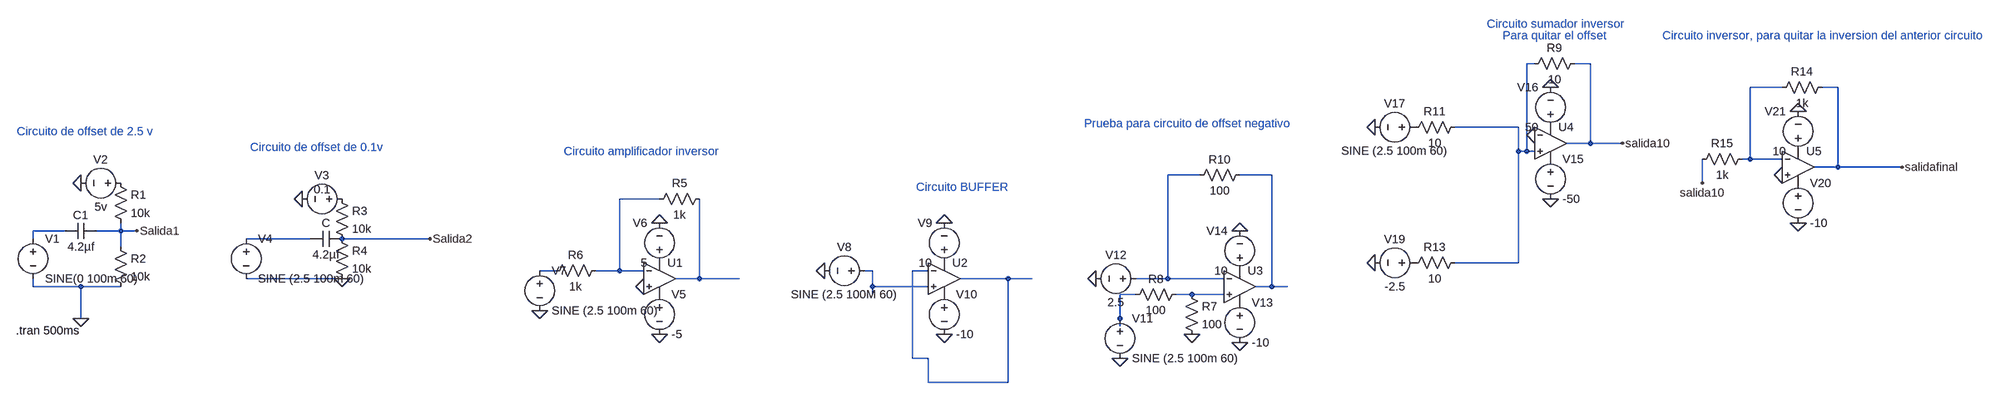
[diagram p0: schematic Simulaciones para la entrada y salida del audio con Amplificadores operacionales.asc]
Simulaciones para la entrada y salida del audio con Amplificadores operacionales.asc, the LTspice schematic file:
Version 4
SHEET 1 4508 680
WIRE 3536 -224 3520 -224
WIRE 3648 -224 3616 -224
WIRE 4032 -176 3968 -176
WIRE 4144 -176 4112 -176
WIRE 3504 -96 3376 -96
WIRE 3648 -64 3648 -224
WIRE 3648 -64 3600 -64
WIRE 3712 -64 3648 -64
WIRE 3504 -48 3504 -96
WIRE 3520 -48 3520 -224
WIRE 3520 -48 3504 -48
WIRE 3536 -48 3520 -48
WIRE 3968 -32 3968 -176
WIRE 3968 -32 3952 -32
WIRE 4032 -32 3968 -32
WIRE 4144 -16 4144 -176
WIRE 4144 -16 4096 -16
WIRE 4272 -16 4144 -16
WIRE 2672 0 2608 0
WIRE 2816 0 2752 0
WIRE 3872 16 3872 -32
WIRE 1408 48 1328 48
WIRE 80 112 16 112
WIRE 192 112 192 96
WIRE 192 112 144 112
WIRE 224 112 192 112
WIRE 16 128 16 112
WIRE 688 128 560 128
WIRE 928 128 752 128
WIRE 192 144 192 112
WIRE 3504 176 3504 -48
WIRE 3504 176 3376 176
WIRE 1200 192 1168 192
WIRE 1328 192 1328 48
WIRE 1328 192 1280 192
WIRE 1376 192 1328 192
WIRE 1856 192 1840 192
WIRE 1968 192 1936 192
WIRE 752 208 560 208
WIRE 1488 208 1488 48
WIRE 1488 208 1440 208
WIRE 1568 208 1488 208
WIRE 2128 208 2032 208
WIRE 2176 208 2128 208
WIRE 2608 208 2608 0
WIRE 2608 208 2544 208
WIRE 2720 208 2608 208
WIRE 16 224 16 208
WIRE 112 224 16 224
WIRE 192 224 112 224
WIRE 1856 224 1856 192
WIRE 1968 224 1856 224
WIRE 2816 224 2816 0
WIRE 2816 224 2784 224
WIRE 2848 224 2816 224
WIRE 1856 240 1856 224
WIRE 2544 240 2512 240
WIRE 2656 240 2624 240
WIRE 2720 240 2656 240
WIRE 112 288 112 224
WIRE 2512 288 2512 240
WIRE 2512 304 2512 288
WIRE 1936 368 1936 192
WIRE 1968 368 1936 368
WIRE 1968 416 1968 368
WIRE 2128 416 2128 208
WIRE 2128 416 1968 416
FLAG 112 288 0
FLAG 112 16 0
FLAG 224 112 Salida1
FLAG 672 48 0
FLAG 928 128 Salida2
FLAG 752 208 0
FLAG 1376 224 0
FLAG 1408 96 0
FLAG 1408 320 0
FLAG 1168 272 0
FLAG 2000 320 0
FLAG 2000 96 0
FLAG 1760 192 0
FLAG 2512 368 0
FLAG 2464 208 0
FLAG 2752 112 0
FLAG 2752 336 0
FLAG 2656 320 0
FLAG 3536 -80 0
FLAG 3568 -176 0
FLAG 3568 48 0
FLAG 3216 176 0
FLAG 3216 -96 0
FLAG 3712 -64 salida10
FLAG 4032 0 0
FLAG 4064 96 0
FLAG 4064 -128 0
FLAG 3872 16 salida10
FLAG 4272 -16 salidafinal
SYMBOL voltage 16 112 R0
WINDOW 123 0 0 Left 0
WINDOW 39 0 0 Left 0
SYMATTR InstName V1
SYMATTR Value SINE(0 100m 60)
SYMBOL voltage 208 16 R90
WINDOW 0 -32 56 VBottom 2
WINDOW 3 32 56 VTop 2
SYMATTR InstName V2
SYMATTR Value 5v
SYMBOL res 176 0 R0
SYMATTR InstName R1
SYMATTR Value 10k
SYMBOL res 176 128 R0
SYMATTR InstName R2
SYMATTR Value 10k
SYMBOL cap 144 96 R90
WINDOW 0 0 32 VBottom 2
WINDOW 3 32 32 VTop 2
SYMATTR InstName C1
SYMATTR Value 4.2µf
SYMBOL cap 688 144 R270
WINDOW 0 32 32 VTop 2
WINDOW 3 0 32 VBottom 2
SYMATTR InstName C
SYMATTR Value 4.2µf
SYMBOL res 736 32 R0
SYMATTR InstName R3
SYMATTR Value 10k
SYMBOL voltage 768 48 R90
WINDOW 0 -32 56 VBottom 2
WINDOW 3 -4 56 VBottom 2
WINDOW 123 0 0 Left 0
WINDOW 39 0 0 Left 0
SYMATTR InstName V3
SYMATTR Value 0.1
SYMBOL res 736 112 R0
SYMATTR InstName R4
SYMATTR Value 10k
SYMBOL voltage 560 112 R0
SYMATTR InstName V4
SYMATTR Value SINE (2.5 100m 60)
SYMBOL voltage 1408 224 R0
SYMATTR InstName V5
SYMATTR Value -5
SYMBOL voltage 1408 192 R180
WINDOW 0 24 96 Left 2
WINDOW 3 24 16 Left 2
SYMATTR InstName V6
SYMATTR Value 5
SYMBOL res 1392 64 R270
WINDOW 0 32 56 VTop 2
WINDOW 3 0 56 VBottom 2
SYMATTR InstName R5
SYMATTR Value 1k
SYMBOL res 1184 208 R270
WINDOW 0 32 56 VTop 2
WINDOW 3 0 56 VBottom 2
SYMATTR InstName R6
SYMATTR Value 1k
SYMBOL voltage 1168 176 R0
SYMATTR InstName V7
SYMATTR Value SINE (2.5 100m 60)
SYMBOL OpAmps\\UniversalOpAmp 1408 208 R0
SYMATTR InstName U1
SYMBOL voltage 1856 192 R90
WINDOW 0 -32 56 VBottom 2
WINDOW 3 32 56 VTop 2
SYMATTR InstName V8
SYMATTR Value SINE (2.5 100M 60)
SYMBOL voltage 2000 192 R180
WINDOW 0 24 96 Left 2
WINDOW 3 24 16 Left 2
SYMATTR InstName V9
SYMATTR Value 10
SYMBOL voltage 2000 224 R0
SYMATTR InstName V10
SYMATTR Value -10
SYMBOL OpAmps\\UniversalOpAmp 2000 208 R0
SYMATTR InstName U2
SYMBOL OpAmps\\UniversalOpAmp 2752 224 R0
SYMATTR InstName U3
SYMBOL voltage 2560 208 R90
WINDOW 0 -32 56 VBottom 2
WINDOW 3 32 56 VTop 2
SYMATTR InstName V12
SYMATTR Value 2.5
SYMBOL voltage 2752 240 R0
SYMATTR InstName V13
SYMATTR Value -10
SYMBOL voltage 2752 208 R180
WINDOW 0 24 96 Left 2
WINDOW 3 24 16 Left 2
SYMATTR InstName V14
SYMATTR Value 10
SYMBOL res 2640 224 R0
SYMATTR InstName R7
SYMATTR Value 100
SYMBOL res 2640 224 R90
WINDOW 0 0 56 VBottom 2
WINDOW 3 32 56 VTop 2
SYMATTR InstName R8
SYMATTR Value 100
SYMBOL voltage 2512 272 R0
SYMATTR InstName V11
SYMATTR Value SINE (2.5 100m 60)
SYMBOL res 2656 16 R270
WINDOW 0 32 56 VTop 2
WINDOW 3 0 56 VBottom 2
SYMATTR InstName R10
SYMATTR Value 100
SYMBOL OpAmps\\UniversalOpAmp 3568 -64 R0
SYMATTR InstName U4
SYMBOL voltage 3568 -48 R0
SYMATTR InstName V15
SYMATTR Value -50
SYMBOL voltage 3568 -80 R180
WINDOW 0 24 96 Left 2
WINDOW 3 24 16 Left 2
SYMATTR InstName V16
SYMATTR Value 50
SYMBOL voltage 3312 -96 R90
WINDOW 0 -32 56 VBottom 2
WINDOW 3 32 56 VTop 2
SYMATTR InstName V17
SYMATTR Value SINE (2.5 100m 60)
SYMBOL voltage 3312 176 R90
WINDOW 0 -32 56 VBottom 2
WINDOW 3 32 56 VTop 2
SYMATTR InstName V19
SYMATTR Value -2.5
SYMBOL res 3520 -208 R270
WINDOW 0 32 56 VTop 2
WINDOW 3 0 56 VBottom 2
SYMATTR InstName R9
SYMATTR Value 10
SYMBOL res 3280 -80 R270
WINDOW 0 32 56 VTop 2
WINDOW 3 0 56 VBottom 2
SYMATTR InstName R11
SYMATTR Value 10
SYMBOL res 3280 192 R270
WINDOW 0 32 56 VTop 2
WINDOW 3 0 56 VBottom 2
SYMATTR InstName R13
SYMATTR Value 10
SYMBOL OpAmps\\UniversalOpAmp 4064 -16 R0
SYMATTR InstName U5
SYMBOL voltage 4064 0 R0
SYMATTR InstName V20
SYMATTR Value -10
SYMBOL voltage 4064 -32 R180
WINDOW 0 24 96 Left 2
WINDOW 3 24 16 Left 2
SYMATTR InstName V21
SYMATTR Value 10
SYMBOL res 4016 -160 R270
WINDOW 0 32 56 VTop 2
WINDOW 3 0 56 VBottom 2
SYMATTR InstName R14
SYMATTR Value 1k
SYMBOL res 3856 -16 R270
WINDOW 0 32 56 VTop 2
WINDOW 3 0 56 VBottom 2
SYMATTR InstName R15
SYMATTR Value 1k
TEXT -18 312 Left 2 !.tran 500ms
TEXT -16 -88 Left 2 ;Circuito de offset de 2.5 v
TEXT 568 -56 Left 2 ;Circuito de offset de 0.1v
TEXT 1216 -48 Left 2 ;Circuito amplificador inversor
TEXT 1944 24 Left 2 ;Circuito BUFFER
TEXT 2440 -104 Left 2 ;Prueba para circuito de offset negativo
TEXT 3440 -304 Left 2 ;Circuito sumador inversor
TEXT 3472 -280 Left 2 ;Para quitar el offset
TEXT 3792 -280 Left 2 ;Circuito inversor, para quitar la inversion del anterior circuito

The netlist it stands for:
* Simulaciones para la entrada y salida del audio con Amplificadores operacionales.asc
V1 N006 0 SINE(0 100m 60)
V2 P001 0 5v
R1 P001 Salida1 10k
R2 Salida1 0 10k
C1 Salida1 N006 4.2µf
C N007 Salida2 4.2µf
R3 P002 Salida2 10k
V3 P002 0 0.1
R4 Salida2 0 10k
V4 N007 0 SINE (2.5 100m 60)
V5 P003 0 -5
V6 P004 0 5
R5 N005 N011 1k
R6 N008 N005 1k
V7 N008 0 SINE (2.5 100m 60)
XU1 0 N005 P004 P003 N011 level1 Avol=1Meg GBW=10Meg Vos=0 En=0 Enk=0 In=0 Ink=0 Rin=500Meg  ; pins In+ In- V+ V- OUT
V8 N009 0 SINE (2.5 100M 60)
V9 P005 0 10
V10 P006 0 -10
XU2 N009 N010 P005 P006 N010 level1 Avol=1Meg GBW=10Meg Vos=0 En=0 Enk=0 In=0 Ink=0 Rin=500Meg  ; pins In+ In- V+ V- OUT
XU3 N013 N003 P007 P008 N004 level1 Avol=1Meg GBW=10Meg Vos=0 En=0 Enk=0 In=0 Ink=0 Rin=500Meg  ; pins In+ In- V+ V- OUT
V12 N003 0 2.5
V13 P008 0 -10
V14 P007 0 10
R7 N013 0 100
R8 N013 N012 100
V11 N012 0 SINE (2.5 100m 60)
R10 N003 N004 100
XU4 N001 0 P009 P010 salida10 level1 Avol=1Meg GBW=10Meg Vos=0 En=0 Enk=0 In=0 Ink=0 Rin=500Meg  ; pins In+ In- V+ V- OUT
V15 P010 0 -50
V16 P009 0 50
V17 P011 0 SINE (2.5 100m 60)
V19 P012 0 -2.5
R9 N001 salida10 10
R11 P011 N001 10
R13 P012 N001 10
XU5 0 N002 P013 P014 salidafinal level1 Avol=1Meg GBW=10Meg Vos=0 En=0 Enk=0 In=0 Ink=0 Rin=500Meg  ; pins In+ In- V+ V- OUT
V20 P014 0 -10
V21 P013 0 10
R14 N002 salidafinal 1k
R15 salida10 N002 1k
.tran 500ms
* Circuito de offset de 2.5 v
* Circuito de offset de 0.1v
* Circuito amplificador inversor
* Circuito BUFFER
* Prueba para circuito de offset negativo
* Circuito sumador inversor
* Para quitar el offset
* Circuito inversor, para quitar la inversion del anterior circuito
.lib UniversalOpAmp1.lib
.backanno
.end